# EAGLE board bluepill-breakout (EAGLE 9.6.2)
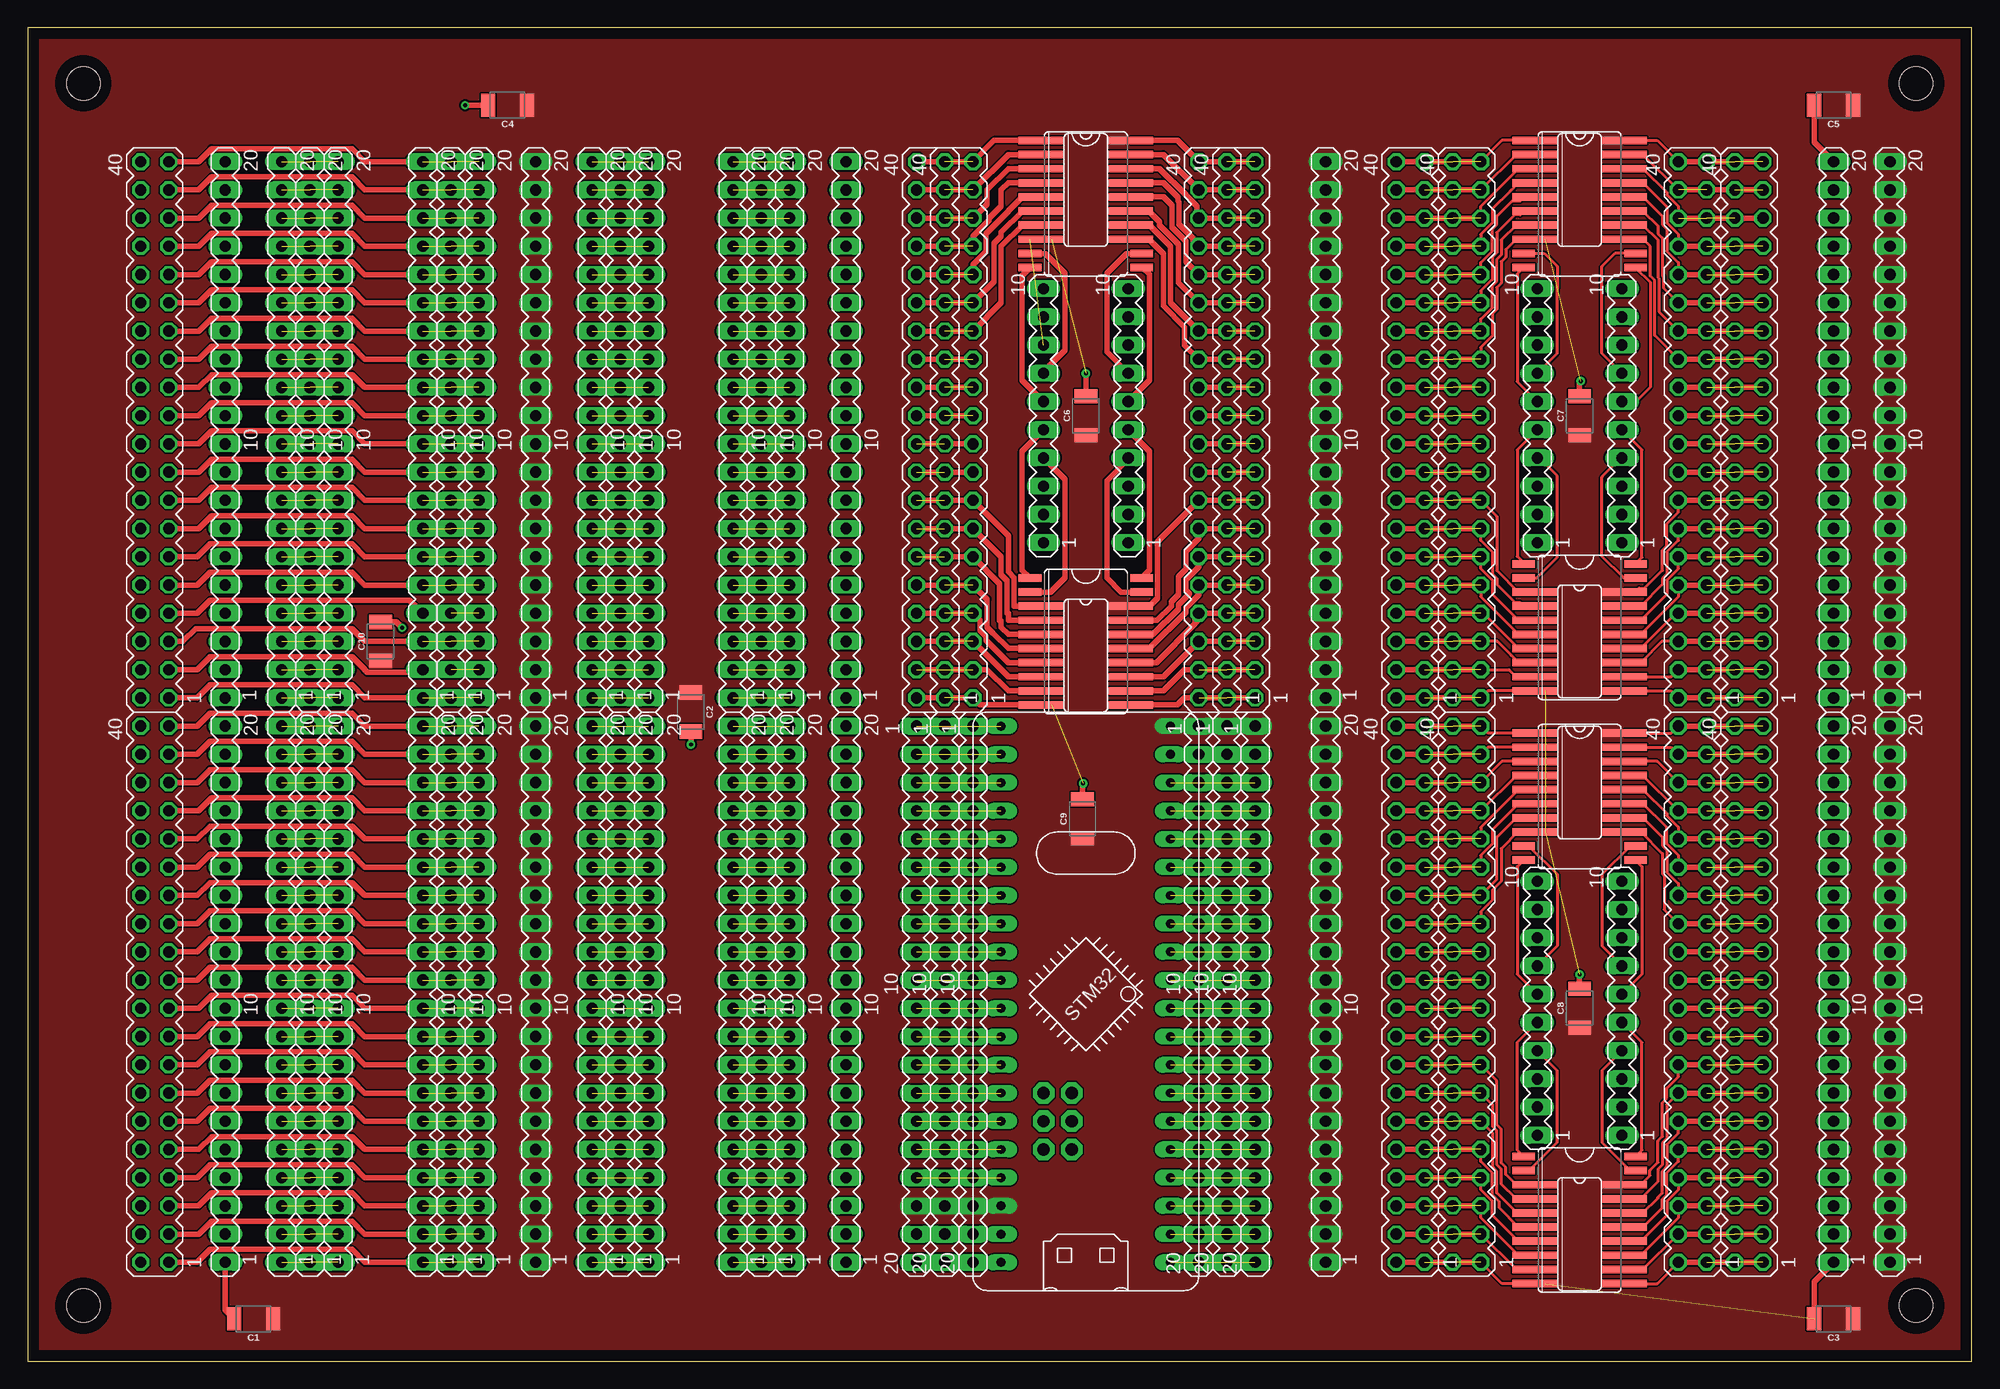
[diagram p3: board, top side]
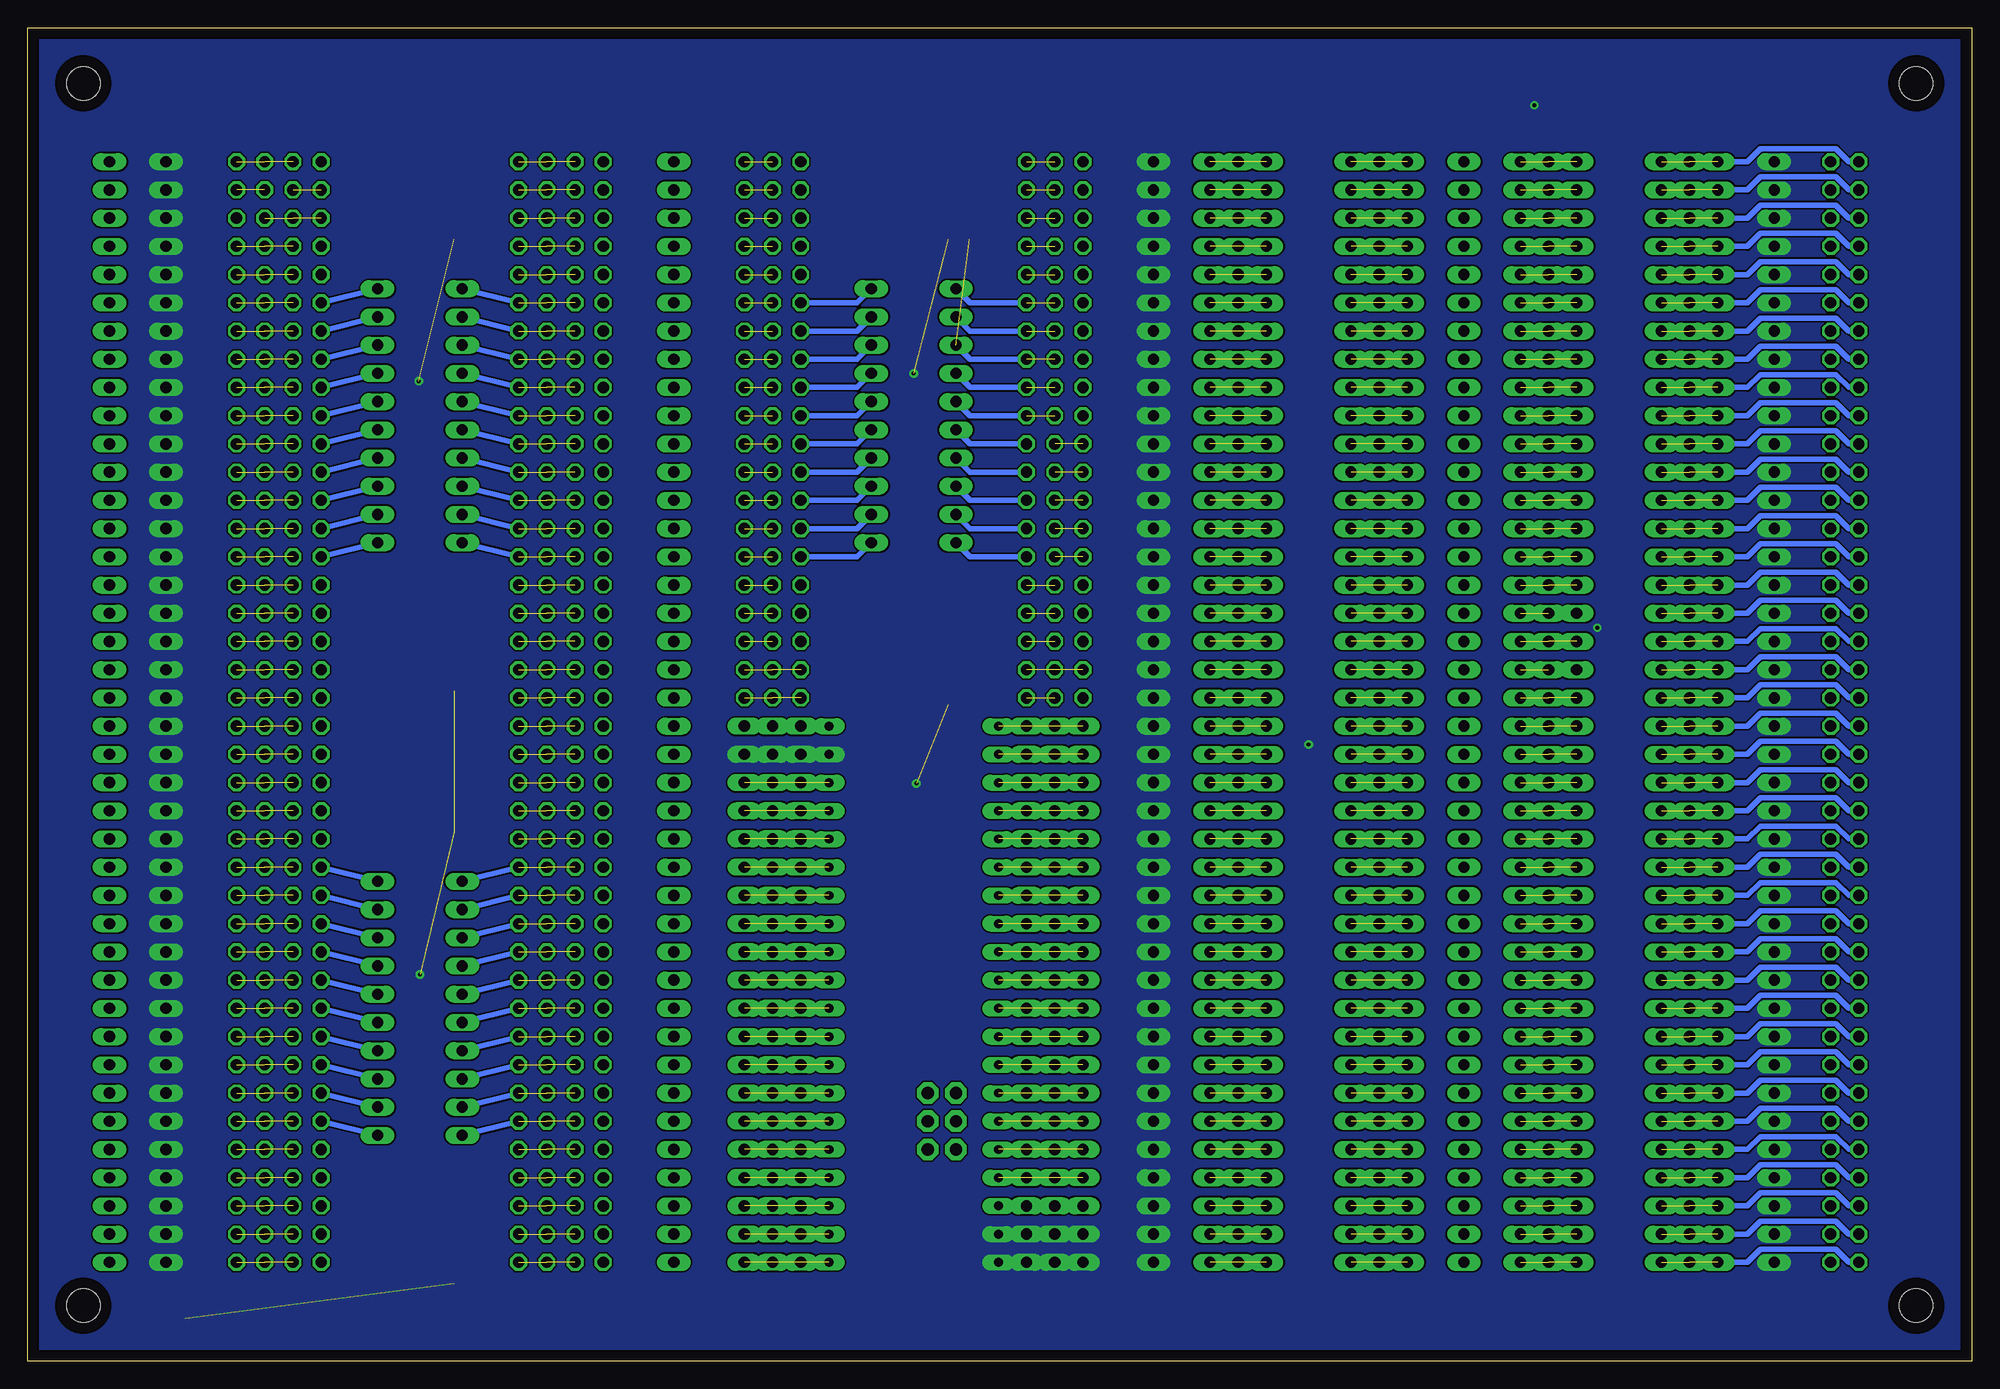
[diagram p4: board, bottom side, seen from below]

Size 175 x 120 mm. Coordinates in mm from the lower left corner, seen from the top.
Outline: 0,0 175,0 175,120 0,120 0,0
Copper layers (1*16): Top 0.035mm / dielectric 1.5mm / Bottom 0.035mm
Design rules "default *": minimum track width 0.5mm, minimum drill 0.35mm, track to track 6mil, track to pad 6mil, pad to pad 6mil, via to via 6mil, smd to smd 6mil, copper to edge 40mil, drill to drill 6mil, minimum pad ring 10mil, minimum via ring 8mil, stop-mask expansion 4mil, vias tented up to drill 0mil, thermal gap 10mil
Holes 3 mm at 5,5 5,115 170,115 170,5

## Footprints (pad centres in the part's own frame; a part is rotated, then mirrored left to right if it is on the bottom)
1210 = smd 1.27 x 2.06: 1 -1.755,0; 2 1.755,0
SO20W = smd 0.66 x 2.032: 1 -5.715,-5.029; 2 -4.445,-5.029; 3 -3.175,-5.029; 4 -1.905,-5.029; 5 -0.635,-5.029; 6 0.635,-5.029; 7 1.905,-5.029; 8 3.175,-5.029; 9 4.445,-5.029; 10 5.715,-5.029; 11 5.715,5.029; 12 4.445,5.029; 13 3.175,5.029; 14 1.905,5.029; 15 0.635,5.029; 16 -0.635,5.029; 17 -1.905,5.029; 18 -3.175,5.029; 19 -4.445,5.029; 20 -5.715,5.029
SO16 = smd 0.66 x 2.032: 1 -4.445,-3.073; 2 -3.175,-3.073; 3 -1.905,-3.073; 4 -0.635,-3.073; 5 0.635,-3.073; 6 1.905,-3.073; 7 3.175,-3.073; 8 4.445,-3.073; 9 4.445,3.073; 10 3.175,3.073; 11 1.905,3.073; 12 0.635,3.073; 13 -0.635,3.073; 14 -1.905,3.073; 15 -3.175,3.073; 16 -4.445,3.073
MA20-1 = drill 1.016 long: 1 -24.13,0; 2 -21.59,0; 3 -19.05,0; 4 -16.51,0; 5 -13.97,0; 6 -11.43,0; 7 -8.89,0; 8 -6.35,0; 9 -3.81,0; 10 -1.27,0; 11 1.27,0; 12 3.81,0; 13 6.35,0; 14 8.89,0; 15 11.43,0; 16 13.97,0; 17 16.51,0; 18 19.05,0; 19 21.59,0; 20 24.13,0
MA20-2 = drill 1.016 octagon: 1 -24.13,-1.27; 2 -24.13,1.27; 3 -21.59,-1.27; 4 -21.59,1.27; 5 -19.05,-1.27; 6 -19.05,1.27; 7 -16.51,-1.27; 8 -16.51,1.27; 9 -13.97,-1.27; 10 -13.97,1.27; 11 -11.43,-1.27; 12 -11.43,1.27; 13 -8.89,-1.27; 14 -8.89,1.27; 15 -6.35,-1.27; 16 -6.35,1.27; 17 -3.81,-1.27; 18 -3.81,1.27; 19 -1.27,-1.27; 20 -1.27,1.27; 21 1.27,-1.27; 22 1.27,1.27; 23 3.81,-1.27; 24 3.81,1.27; 25 6.35,-1.27; 26 6.35,1.27; 27 8.89,-1.27; 28 8.89,1.27; 29 11.43,-1.27; 30 11.43,1.27; 31 13.97,-1.27; 32 13.97,1.27; 33 16.51,-1.27; 34 16.51,1.27; 35 19.05,-1.27; 36 19.05,1.27; 37 21.59,-1.27; 38 21.59,1.27; 39 24.13,-1.27; 40 24.13,1.27
MA10-1 = drill 1.016 long: 1 -11.43,0; 2 -8.89,0; 3 -6.35,0; 4 -3.81,0; 5 -1.27,0; 6 1.27,0; 7 3.81,0; 8 6.35,0; 9 8.89,0; 10 11.43,0
BLUE_PILL_ADV = drill 0.8 pad 1.422 long: P$1 10.16,-30.48; P$2 10.16,-27.94; P$3 10.16,-25.4; P$4 10.16,-22.86; P$5 10.16,-20.32; P$6 10.16,-17.78; P$7 10.16,-15.24; P$8 10.16,-12.7; P$9 10.16,-10.16; P$10 10.16,-7.62; P$11 10.16,-5.08; P$12 10.16,-2.54; P$13 10.16,0; P$14 10.16,2.54; P$15 10.16,5.08; P$16 10.16,7.62; P$17 10.16,10.16; P$18 10.16,12.7; P$19 10.16,15.24; P$20 10.16,17.78; P$21 -5.08,-30.48; P$22 -5.08,-27.94; P$23 -5.08,-25.4; P$24 -5.08,-22.86; P$25 -5.08,-20.32; P$26 -5.08,-17.78; P$27 -5.08,-15.24; P$28 -5.08,-12.7; P$29 -5.08,-10.16; P$30 -5.08,-7.62; P$31 -5.08,-5.08; P$32 -5.08,-2.54; P$33 -5.08,0; P$34 -5.08,2.54; P$35 -5.08,5.08; P$36 -5.08,7.62; P$37 -5.08,10.16; P$38 -5.08,12.7; P$39 -5.08,15.24; P$40 -5.08,17.78 | drill 1.1 pad 1.93 octagon: P$42 -1.27,-20.32; P$43 -1.27,-17.78; P$44 -1.27,-15.24; P$45 1.27,-15.24; P$46 1.27,-17.78; P$47 1.27,-20.32

## Placement (x,y rotation side)
C1  22UF-1210-16V-20%  [1210]  20.32,3.81 180 top
C2  22UF-1210-16V-20%  [1210]  59.69,58.42 270 top
C3  22UF-1210-16V-20%  [1210]  162.56,3.81 180 top
C4  22UF-1210-16V-20%  [1210]  43.18,113.03 180 top
C5  22UF-1210-16V-20%  [1210]  162.56,113.03 180 top
C6  22UF-1210-16V-20%  [1210]  95.25,85.09 90 top
C7  22UF-1210-16V-20%  [1210]  139.7,85.09 90 top
C8  22UF-1210-16V-20%  [1210]  139.7,31.75 90 top
C9  22UF-1210-16V-20%  [1210]  94.95,48.8 90 top
C10  22UF-1210-16V-20%  [1210]  31.75,64.77 90 top
IC2  74LS373DW  [SO20W]  139.7,104.14 270 top
IC3  74LS373DW  [SO20W]  139.7,66.04 270 top
IC4  74LS373DW  [SO20W]  95.25,104.14 270 top
IC5  74LS158D  [SO16]  139.7,105.41 270 top
IC6  74LS373DW  [SO20W]  139.7,50.8 270 top
IC7  74LS373DW  [SO20W]  139.7,12.7 270 top
IC8  74LS158D  [SO16]  139.7,64.77 270 top
IC9  74LS158D  [SO16]  139.7,52.07 270 top
IC10  74LS158D  [SO16]  139.7,11.43 270 top
IC11  74LS373DW  [SO20W]  95.25,64.77 270 top
IC12  74LS158D  [SO16]  95.25,105.41 270 top
IC13  74LS158D  [SO16]  95.25,63.5 270 top
SV1  [MA20-1]  27.94,83.82 90 top
SV2  [MA20-1]  40.64,83.82 90 top
SV3  [MA20-1]  22.86,83.82 90 top
SV4  [MA20-1]  25.4,83.82 90 top
SV5  [MA20-2]  11.43,83.82 90 top
SV6  [MA20-2]  124.46,83.82 90 top
SV7  [MA20-1]  35.56,83.82 90 top
SV8  [MA20-1]  50.8,33.02 90 top
SV9  [MA20-1]  38.1,83.82 90 top
SV10  [MA20-1]  45.72,83.82 90 top
SV11  [MA20-2]  11.43,33.02 90 top
SV12  [MA20-1]  22.86,33.02 90 top
SV13  [MA20-1]  35.56,33.02 90 top
SV14  [MA20-1]  25.4,33.02 90 top
SV15  [MA20-1]  27.94,33.02 90 top
SV16  [MA20-1]  38.1,33.02 90 top
SV17  [MA20-1]  40.64,33.02 90 top
SV18  [MA20-1]  45.72,33.02 90 top
SV19  [MA20-1]  17.78,33.02 90 top
SV20  [MA20-1]  17.78,83.82 90 top
SV21  [MA20-1]  63.5,33.02 90 top
SV22  [MA20-1]  53.34,33.02 90 top
SV23  [MA20-1]  55.88,33.02 90 top
SV24  [MA20-1]  66.04,33.02 90 top
SV25  [MA20-1]  68.58,33.02 90 top
SV26  [MA20-2]  129.54,83.82 90 top
SV27  [MA20-1]  50.8,83.82 90 top
SV28  [MA20-1]  63.5,83.82 90 top
SV29  [MA20-1]  53.34,83.82 90 top
SV30  [MA20-1]  55.88,83.82 90 top
SV31  [MA20-1]  66.04,83.82 90 top
SV32  [MA20-1]  68.58,83.82 90 top
SV33  [MA20-2]  149.86,83.82 90 top
SV34  [MA20-2]  154.94,83.82 90 top
SV35  [MA10-1]  135.89,85.09 90 top
SV36  [MA10-1]  135.89,31.75 90 top
SV37  [MA20-2]  124.46,33.02 90 top
SV38  [MA20-2]  129.54,33.02 90 top
SV39  [MA20-2]  154.94,33.02 90 top
SV40  [MA20-2]  149.86,33.02 90 top
SV41  [MA10-1]  143.51,31.75 90 top
SV42  [MA10-1]  143.51,85.09 90 top
SV43  [MA20-1]  116.84,33.02 90 top
SV44  [MA20-1]  105.41,33.02 270 top
SV45  [MA20-1]  107.95,33.02 270 top
SV46  [MA20-1]  110.49,33.02 270 top
SV47  [MA20-1]  85.09,33.02 270 top
SV48  [MA20-1]  82.55,33.02 270 top
SV49  [MA20-1]  116.84,83.82 90 top
SV50  [MA20-1]  80.01,33.02 270 top
SV51  [MA20-1]  73.66,33.02 90 top
SV52  [MA20-1]  73.66,83.82 90 top
SV53  [MA20-1]  167.64,33.02 90 top
SV54  [MA20-1]  167.64,83.82 90 top
SV55  [MA20-1]  162.56,33.02 90 top
SV56  [MA20-1]  162.56,83.82 90 top
SV57  [MA20-2]  83.82,83.82 90 top
SV58  [MA20-2]  81.28,83.82 90 top
SV59  [MA20-2]  109.22,83.82 90 top
SV60  [MA20-2]  106.68,83.82 90 top
SV61  [MA10-1]  91.44,85.09 90 top
SV62  [MA10-1]  99.06,85.09 90 top
U$1  [BLUE_PILL_ADV]  92.71,39.37 0 top

## Tracks (layer width: path | path; a pad name or v marks a point on that pad's centre or on a via)
GND  (via drill 0.35)  (6 unrouted)
  Top 0.5: C4.2 v39.37,113.03 | C6.2 v95.25,88.9 | SV56.20 160.81,109.7 C5.2 | C3.2 160.81,7.13 SV55.1 | C1.2 17.78,4.59 SV19.1 | C10.2 33.17,66.53 v33.7,66 | C2.2 v59.69,55.51 v59.7,55.5 | v95,52 94.95,51.95 C9.2 | C7.2 139.7,88.1 v139.8,88.2 | C8.2 v139.7,34.8
  pour Bottom (no thermals): -0.84,121.29 -0.84,-2.15 176.54,-2.15 176.54,121.29
N$1  (2 unrouted)
  Bottom 0.5: SV5.2 11.05,59.69 12.22,60.85 19.02,60.85 20.19,59.69 SV1.1
N$2  (2 unrouted)
  Bottom 0.5: SV5.4 11.05,62.23 12.22,63.39 19.02,63.39 20.19,62.23 SV1.2
N$3  (2 unrouted)
  Bottom 0.5: SV5.6 11.05,64.77 12.22,65.93 19.02,65.93 20.19,64.77 SV1.3
N$4  (2 unrouted)
  Bottom 0.5: SV5.8 11.05,67.31 12.22,68.47 19.02,68.47 20.19,67.31 SV1.4
N$5  (2 unrouted)
  Bottom 0.5: SV5.10 11.05,69.85 12.22,71.01 19.02,71.01 20.19,69.85 SV1.5
N$6  (2 unrouted)
  Bottom 0.5: SV5.12 11.05,72.39 12.22,73.55 19.02,73.55 20.19,72.39 SV1.6
N$7  (2 unrouted)
  Bottom 0.5: SV5.14 11.05,74.93 12.22,76.09 19.02,76.09 20.19,74.93 SV1.7
N$8  (2 unrouted)
  Bottom 0.5: SV5.16 11.05,77.47 12.22,78.63 19.02,78.63 20.19,77.47 SV1.8
N$9  (2 unrouted)
  Bottom 0.5: SV5.18 11.05,80.01 12.22,81.17 19.02,81.17 20.19,80.01 SV1.9
N$10  (2 unrouted)
  Bottom 0.5: SV5.20 11.05,82.55 12.22,83.71 19.02,83.71 20.19,82.55 SV1.10
N$11  (2 unrouted)
  Bottom 0.5: SV5.22 11.05,85.09 12.22,86.25 19.02,86.25 20.19,85.09 SV1.11
N$12  (2 unrouted)
  Bottom 0.5: SV5.24 11.05,87.63 12.22,88.79 19.02,88.79 20.19,87.63 SV1.12
N$13  (2 unrouted)
  Bottom 0.5: SV5.26 11.05,90.17 12.22,91.33 19.02,91.33 20.19,90.17 SV1.13
N$14  (2 unrouted)
  Bottom 0.5: SV5.28 11.05,92.71 12.22,93.87 19.02,93.87 20.19,92.71 SV1.14
N$15  (2 unrouted)
  Bottom 0.5: SV5.30 11.05,95.25 12.22,96.41 19.02,96.41 20.19,95.25 SV1.15
N$16  (2 unrouted)
  Bottom 0.5: SV5.32 11.05,97.79 12.22,98.95 19.02,98.95 20.19,97.79 SV1.16
N$17  (2 unrouted)
  Bottom 0.5: SV5.34 11.05,100.33 12.22,101.49 19.02,101.49 20.19,100.33 SV1.17
N$18  (2 unrouted)
  Bottom 0.5: SV5.36 11.05,102.87 12.22,104.03 19.02,104.03 20.19,102.87 SV1.18
N$19  (2 unrouted)
  Bottom 0.5: SV5.38 11.05,105.41 12.22,106.57 19.02,106.57 20.19,105.41 SV1.19
N$20  (2 unrouted)
  Bottom 0.5: SV5.40 11.05,107.95 12.22,109.11 19.02,109.11 20.19,107.95 SV1.20
N$21  (2 unrouted)
  Top 0.5: SV5.1 15.24,59.69 16.4,60.85 29.18,60.85 30.35,59.69 SV2.1
N$22  (1 unrouted)
  Top 0.5: SV5.3 15.24,62.23 16.4,63.39 29.18,63.39 30.32,62.26 30.32,62.21 30.55,61.98 35.31,61.98 SV7.2 SV2.2
N$23  (2 unrouted)
  Top 0.5: SV5.5 13.97,64.77 15.13,65.93 29.18,65.93 30.35,64.77 SV2.3
N$24  (1 unrouted)
  Top 0.5: SV5.7 15.24,67.31 16.4,68.47 29.18,68.47 34.4,68.47 SV7.4 SV2.4
N$25  (2 unrouted)
  Top 0.5: SV5.9 15.24,69.85 16.4,71.01 29.18,71.01 30.35,69.85 SV2.5
N$26  (2 unrouted)
  Top 0.5: SV5.11 15.24,72.39 16.4,73.55 29.18,73.55 30.35,72.39 SV2.6
N$27  (2 unrouted)
  Top 0.5: SV5.13 15.37,74.93 16.54,76.09 29.18,76.09 30.35,74.93 SV2.7
N$28  (2 unrouted)
  Top 0.5: SV5.15 15.37,77.47 16.54,78.63 29.18,78.63 30.35,77.47 SV2.8
N$29  (2 unrouted)
  Top 0.5: SV5.17 15.37,80.01 16.54,81.17 29.18,81.17 30.35,80.01 SV2.9
N$30  (2 unrouted)
  Top 0.5: SV5.19 15.37,82.55 16.54,83.71 29.18,83.71 30.35,82.55 SV2.10
N$31  (2 unrouted)
  Top 0.5: SV5.21 15.37,85.09 16.54,86.25 29.18,86.25 30.35,85.09 SV2.11
N$32  (2 unrouted)
  Top 0.5: SV5.23 15.37,87.63 16.54,88.79 29.18,88.79 30.35,87.63 SV2.12
N$33  (2 unrouted)
  Top 0.5: SV5.25 15.37,90.17 16.54,91.33 29.18,91.33 30.35,90.17 SV2.13
N$34  (2 unrouted)
  Top 0.5: SV5.27 15.37,92.71 16.54,93.87 29.18,93.87 30.35,92.71 SV2.14
N$35  (2 unrouted)
  Top 0.5: SV5.29 15.37,95.25 16.54,96.41 29.18,96.41 30.35,95.25 SV2.15
N$36  (2 unrouted)
  Top 0.5: SV5.31 15.37,97.79 16.54,98.95 29.18,98.95 30.35,97.79 SV2.16
N$37  (2 unrouted)
  Top 0.5: SV5.33 15.37,100.33 16.54,101.49 29.18,101.49 30.35,100.33 SV2.17
N$38  (2 unrouted)
  Top 0.5: SV5.35 15.37,102.87 16.54,104.03 29.18,104.03 30.35,102.87 SV2.18
N$39  (2 unrouted)
  Top 0.5: SV5.37 15.37,105.41 16.54,106.57 29.18,106.57 30.35,105.41 SV2.19
N$40  (2 unrouted)
  Top 0.5: SV5.39 15.37,107.95 16.54,109.11 29.18,109.11 30.35,107.95 SV2.20
N$41  (2 unrouted)
  Bottom 0.5: SV11.2 11.05,8.89 12.22,10.05 19.02,10.05 20.19,8.89 SV15.1
N$42  (2 unrouted)
  Bottom 0.5: SV11.4 11.05,11.43 12.22,12.59 19.02,12.59 20.19,11.43 SV15.2
N$43  (2 unrouted)
  Bottom 0.5: SV11.6 11.05,13.97 12.22,15.13 19.02,15.13 20.19,13.97 SV15.3
N$44  (2 unrouted)
  Bottom 0.5: SV11.8 11.05,16.51 12.22,17.67 19.02,17.67 20.19,16.51 SV15.4
N$45  (2 unrouted)
  Bottom 0.5: SV11.10 11.05,19.05 12.22,20.21 19.02,20.21 20.19,19.05 SV15.5
N$46  (2 unrouted)
  Bottom 0.5: SV11.12 11.05,21.59 12.22,22.75 19.02,22.75 20.19,21.59 SV15.6
N$47  (2 unrouted)
  Bottom 0.5: SV11.14 11.05,24.13 12.22,25.29 19.02,25.29 20.19,24.13 SV15.7
N$48  (2 unrouted)
  Bottom 0.5: SV11.16 11.05,26.67 12.22,27.83 19.02,27.83 20.19,26.67 SV15.8
N$49  (2 unrouted)
  Bottom 0.5: SV11.18 11.05,29.21 12.22,30.37 19.02,30.37 20.19,29.21 SV15.9
N$50  (2 unrouted)
  Bottom 0.5: SV11.20 11.05,31.75 12.22,32.91 19.02,32.91 20.19,31.75 SV15.10
N$51  (2 unrouted)
  Bottom 0.5: SV11.22 11.05,34.29 12.22,35.45 19.02,35.45 20.19,34.29 SV15.11
N$52  (2 unrouted)
  Bottom 0.5: SV11.24 11.05,36.83 12.22,37.99 19.02,37.99 20.19,36.83 SV15.12
N$53  (2 unrouted)
  Bottom 0.5: SV11.26 11.05,39.37 12.22,40.53 19.02,40.53 20.19,39.37 SV15.13
N$54  (2 unrouted)
  Bottom 0.5: SV11.28 11.05,41.91 12.22,43.07 19.02,43.07 20.19,41.91 SV15.14
N$55  (2 unrouted)
  Bottom 0.5: SV11.30 11.05,44.45 12.22,45.61 19.02,45.61 20.19,44.45 SV15.15
N$56  (2 unrouted)
  Bottom 0.5: SV11.32 11.05,46.99 12.22,48.15 19.02,48.15 20.19,46.99 SV15.16
N$57  (2 unrouted)
  Bottom 0.5: SV11.34 11.05,49.53 12.22,50.69 19.02,50.69 20.19,49.53 SV15.17
N$58  (2 unrouted)
  Bottom 0.5: SV11.36 11.05,52.07 12.22,53.23 19.02,53.23 20.19,52.07 SV15.18
N$59  (2 unrouted)
  Bottom 0.5: SV11.38 11.05,54.61 12.22,55.77 19.02,55.77 20.19,54.61 SV15.19
N$60  (2 unrouted)
  Bottom 0.5: SV11.40 11.05,57.15 12.22,58.31 19.02,58.31 20.19,57.15 SV15.20
N$61  (2 unrouted)
  Top 0.5: SV11.1 15.24,8.89 16.4,10.05 29.18,10.05 30.35,8.89 SV17.1
N$62  (2 unrouted)
  Top 0.5: SV11.3 15.37,11.43 16.54,12.59 29.18,12.59 30.35,11.43 SV17.2
N$63  (2 unrouted)
  Top 0.5: SV11.5 15.37,13.97 16.54,15.13 29.18,15.13 30.35,13.97 SV17.3
N$64  (2 unrouted)
  Top 0.5: SV11.7 15.24,16.51 16.4,17.67 29.18,17.67 30.35,16.51 SV17.4
N$65  (2 unrouted)
  Top 0.5: SV11.9 15.37,19.05 16.54,20.21 29.18,20.21 30.35,19.05 SV17.5
N$66  (2 unrouted)
  Top 0.5: SV11.11 15.24,21.59 16.4,22.75 29.18,22.75 30.35,21.59 SV17.6
N$67  (2 unrouted)
  Top 0.5: SV11.13 15.24,24.13 16.4,25.29 29.18,25.29 30.35,24.13 SV17.7
N$68  (2 unrouted)
  Top 0.5: SV11.15 15.24,26.67 16.4,27.83 29.18,27.83 30.35,26.67 SV17.8
N$69  (2 unrouted)
  Top 0.5: SV11.17 15.24,29.21 16.4,30.37 29.18,30.37 30.35,29.21 SV17.9
N$70  (2 unrouted)
  Top 0.5: SV11.19 15.37,31.75 16.54,32.91 29.18,32.91 30.35,31.75 SV17.10
N$71  (2 unrouted)
  Top 0.5: SV11.21 15.24,34.29 16.4,35.45 29.18,35.45 30.35,34.29 SV17.11
N$72  (2 unrouted)
  Top 0.5: SV11.23 15.24,36.83 16.4,37.99 29.18,37.99 30.35,36.83 SV17.12
N$73  (2 unrouted)
  Top 0.5: SV11.25 15.24,39.37 16.4,40.53 29.18,40.53 30.35,39.37 SV17.13
N$74  (2 unrouted)
  Top 0.5: SV11.27 15.24,41.91 16.4,43.07 29.18,43.07 30.35,41.91 SV17.14
N$75  (2 unrouted)
  Top 0.5: SV11.29 15.24,44.45 16.4,45.61 29.18,45.61 30.35,44.45 SV17.15
N$76  (2 unrouted)
  Top 0.5: SV11.31 15.24,46.99 16.4,48.15 29.18,48.15 30.35,46.99 SV17.16
N$77  (2 unrouted)
  Top 0.5: SV11.33 15.37,49.53 16.54,50.69 29.18,50.69 30.35,49.53 SV17.17
N$78  (2 unrouted)
  Top 0.5: SV11.35 15.24,52.07 16.4,53.23 29.18,53.23 30.35,52.07 SV17.18
N$79  (2 unrouted)
  Top 0.5: SV11.37 15.24,54.61 16.4,55.77 29.18,55.77 30.35,54.61 SV17.19
N$80  (2 unrouted)
  Top 0.5: SV11.39 15.24,57.15 16.4,58.31 29.18,58.31 30.35,57.15 SV17.20
N$81  (2 unrouted)
N$82  (2 unrouted)
N$83  (2 unrouted)
N$84  (2 unrouted)
N$85  (2 unrouted)
N$86  (2 unrouted)
N$87  (2 unrouted)
N$88  (2 unrouted)
N$89  (2 unrouted)
N$90  (2 unrouted)
N$91  (2 unrouted)
N$92  (2 unrouted)
N$93  (2 unrouted)
N$94  (2 unrouted)
N$95  (2 unrouted)
N$96  (2 unrouted)
N$97  (2 unrouted)
N$98  (2 unrouted)
N$99  (2 unrouted)
N$100  (2 unrouted)
N$101  (2 unrouted)
N$102  (2 unrouted)
N$103  (2 unrouted)
N$104  (2 unrouted)
N$105  (2 unrouted)
N$106  (2 unrouted)
N$107  (2 unrouted)
N$108  (2 unrouted)
N$109  (2 unrouted)
N$110  (2 unrouted)
N$111  (2 unrouted)
N$112  (2 unrouted)
N$113  (2 unrouted)
N$114  (2 unrouted)
N$115  (2 unrouted)
N$116  (2 unrouted)
N$117  (2 unrouted)
N$118  (2 unrouted)
N$119  (2 unrouted)
N$120  (2 unrouted)
N$121  (2 unrouted)
N$122  (2 unrouted)
N$123  (2 unrouted)
N$124  (2 unrouted)
N$125  (2 unrouted)
N$126  (2 unrouted)
N$127  (2 unrouted)
N$128  (2 unrouted)
N$129  (2 unrouted)
N$130  (2 unrouted)
N$131  (2 unrouted)
N$132  (2 unrouted)
N$133  (2 unrouted)
N$134  (2 unrouted)
N$135  (2 unrouted)
N$136  (2 unrouted)
N$137  (2 unrouted)
N$138  (2 unrouted)
N$139  (2 unrouted)
N$140  (2 unrouted)
N$141  (2 unrouted)
N$142  (2 unrouted)
N$143  (2 unrouted)
N$144  (2 unrouted)
N$145  (2 unrouted)
N$146  (2 unrouted)
N$147  (2 unrouted)
N$148  (2 unrouted)
N$149  (2 unrouted)
N$150  (2 unrouted)
N$151  (2 unrouted)
N$152  (2 unrouted)
N$153  (2 unrouted)
N$154  (2 unrouted)
N$155  (2 unrouted)
N$156  (2 unrouted)
N$157  (2 unrouted)
N$158  (2 unrouted)
N$159  (2 unrouted)
N$160  (2 unrouted)
N$161  (2 unrouted)
  Top 0.25: IC3.10 131.44,60.33 SV26.1
  Top 0.5: SV26.1 SV6.2
N$162  (2 unrouted)
  Top 0.25: SV26.3 133.35,62.23 133.99,61.59 IC3.9
  Top 0.5: SV26.3 SV6.4
N$163  (2 unrouted)
  Top 0.25: SV26.5 132.3,64.77 133.54,63.53 134.2,62.87 IC3.8
  Top 0.5: SV26.5 SV6.6
N$164  (2 unrouted)
  Top 0.25: SV26.7 131.03,67.31 134.2,64.14 IC3.7
  Top 0.5: SV26.7 SV6.8
N$165  (2 unrouted)
  Top 0.25: SV26.9 130.81,68.8 134.2,65.41 IC3.6
  Top 0.5: SV26.9 SV6.10
N$166  (2 unrouted)
  Top 0.25: SV26.11 130.81,71.32 131.85,70.28 131.85,69.03 134.2,66.67 IC3.5
  Top 0.5: SV26.11 SV6.12
  Bottom 0.5: SV26.11 SV35.1
N$167  (2 unrouted)
  Top 0.25: IC3.4 134.33,68.29 133.86,68.29 132.25,69.89 132.25,70.45 131.85,70.85 131.85,72.82 130.81,73.86 SV26.13
  Top 0.5: SV26.13 SV6.14
  Bottom 0.5: SV35.2 SV26.13
N$168  (2 unrouted)
  Top 0.25: SV26.15 132.25,76.03 132.25,71.17 134.2,69.22 IC3.3
  Top 0.5: SV26.15 SV6.16
  Bottom 0.5: SV35.3 SV26.15
N$169  (2 unrouted)
  Top 0.25: IC3.2 134.71,70.45 135.8,70.45 137.69,72.34 137.69,79.68 136.09,81.28 SV35.4
  Top 0.5: SV26.17 SV6.18
  Bottom 0.5: SV35.4 SV26.17
N$170  (2 unrouted)
  Top 0.25: IC3.1 134.67,71.85 134.09,72.43 134.09,82.02 SV35.5
  Top 0.5: SV26.19 SV6.20
  Bottom 0.5: SV35.5 SV26.19
N$171  (2 unrouted)
  Top 0.25: IC2.10 134.09,97.85 134.09,88.16 SV35.6
  Top 0.5: SV26.21 SV6.22
  Bottom 0.5: SV35.6 SV26.21
N$172  (2 unrouted)
  Top 0.25: 133.99,99.69 IC2.9 136.53,99.69 137.69,98.53 137.69,96.52 | SV35.7 137.69,90.7 137.69,96.52 | 137.69,96.52 137.69,97.14
  Top 0.5: SV26.23 SV6.24
  Bottom 0.5: SV35.7 SV26.23
N$173  (2 unrouted)
  Top 0.25: SV26.25 130.81,91.24 131.85,92.28 131.85,94.25 132.25,94.65 132.25,96.62 132.65,97.03 132.65,98.95 133.06,99.35 133.06,100.04 133.99,100.97 IC2.8
  Top 0.5: SV26.25 SV6.26
  Bottom 0.5: SV35.8 SV26.25
N$174  (2 unrouted)
  Top 0.25: IC2.7 133.99,102.23 132.65,100.9 132.65,99.57 132.25,99.16 132.25,97.19 131.85,96.79 131.85,94.82 130.81,93.78 SV26.27
  Top 0.5: SV26.27 SV6.28
  Bottom 0.5: SV35.9 SV26.27
N$175  (2 unrouted)
  Top 0.25: IC2.6 134.33,103.16 133.86,103.16 132.25,101.56 132.25,99.73 131.85,99.33 131.85,97.36 130.81,96.32 SV26.29
  Top 0.5: SV26.29 SV6.30
  Bottom 0.5: SV35.10 SV26.29
N$176  (2 unrouted)
  Top 0.25: IC2.5 134.33,104.43 133.64,104.43 132.25,103.04 132.25,102.27 131.85,101.87 131.85,99.9 130.81,98.86 SV26.31
  Top 0.5: SV6.32 SV26.31
N$177  (2 unrouted)
  Top 0.25: SV26.33 130.81,101.4 131.85,102.44 131.85,103.69 133.46,105.3 | 133.54,105.38 133.46,105.3 | 133.46,105.3 134.2,106.05 IC2.4
  Top 0.5: SV6.34 SV26.33
N$178  (2 unrouted)
  Top 0.25: SV26.35 130.81,103.92 134.2,107.31 IC2.3
  Top 0.5: SV6.36 SV26.35
N$179  (2 unrouted)
  Top 0.25: IC2.2 133.99,108.58 SV26.37
  Top 0.5: SV6.38 SV26.37
N$180  (2 unrouted)
  Top 0.25: IC2.1 132.72,109.86 SV26.39
  Top 0.5: SV26.39 SV6.40
N$181  (2 unrouted)
  Top 0.25: IC3.11 147.96,60.33 SV33.2
  Top 0.5: SV33.2 SV34.1
N$182  (2 unrouted)
  Top 0.25: IC3.12 147.96,61.59 SV33.4
  Top 0.5: SV33.4 SV34.3
N$183  (2 unrouted)
  Top 0.25: SV33.6 147.1,64.77 145.2,62.87 IC3.13
  Top 0.5: SV33.6 SV34.5
N$184  (2 unrouted)
  Top 0.25: SV33.8 148.37,67.31 145.2,64.14 IC3.14
  Top 0.5: SV33.8 SV34.7
N$185  (2 unrouted)
  Top 0.25: SV33.10 148.59,68.8 145.2,65.41 IC3.15
  Top 0.5: SV33.10 SV34.9
N$186  (2 unrouted)
  Top 0.25: SV33.12 148.59,71.32 147.55,70.28 147.55,69.03 145.2,66.67 IC3.16
  Top 0.5: SV33.12 SV34.11
  Bottom 0.5: SV42.1 SV33.12
N$187  (2 unrouted)
  Top 0.25: SV33.14 148.59,73.86 147.55,72.82 147.55,70.85 147.15,70.45 147.15,69.89 145.2,67.94 IC3.17
  Top 0.5: SV33.14 SV34.13
  Bottom 0.5: SV33.14 SV42.2
N$188  (2 unrouted)
  Top 0.25: IC3.18 145.07,69.56 145.54,69.56 147.15,71.17 147.15,72.99 147.55,73.39 147.55,75.36 148.59,76.4 SV33.16
  Top 0.5: SV33.16 SV34.15
  Bottom 0.5: SV33.16 SV42.3
N$189  (2 unrouted)
  Top 0.25: IC3.19 143.66,70.48 141.71,72.44 141.71,79.57 143.42,81.28 SV42.4
  Top 0.5: SV33.18 SV34.17
  Bottom 0.5: SV33.18 SV42.4
N$190  (2 unrouted)
  Top 0.25: IC3.20 145.31,72.33 145.31,82.02 SV42.5
  Top 0.5: SV33.20 SV34.19
  Bottom 0.5: SV33.20 SV42.5
N$191  (2 unrouted)
  Top 0.25: IC2.11 146.05,97.1 146.05,87.63 144.78,86.36 SV42.6
  Top 0.5: SV34.21 SV33.22
  Bottom 0.5: SV33.22 SV42.6
N$192  (2 unrouted)
  Top 0.25: IC2.12 142.88,99.69 141.71,98.53 141.71,90.7 SV42.7
  Top 0.5: SV34.23 SV33.24
  Bottom 0.5: SV33.24 SV42.7
N$193  (2 unrouted)
  Top 0.25: IC2.13 145.41,100.97 146.05,100.33 146.05,97.67 146.45,97.27 146.45,92.31 SV33.26
  Top 0.5: SV34.25 SV33.26
  Bottom 0.5: SV33.26 SV42.8
N$194  (2 unrouted)
  Top 0.25: IC2.14 145.41,102.23 146.75,100.9 146.75,97.55 146.85,97.44 146.85,94.44 SV33.28
  Top 0.5: SV34.27 SV33.28
  Bottom 0.5: SV33.28 SV42.9
N$195  (2 unrouted)
  Top 0.25: IC2.15 145.41,103.5 146.75,102.17 146.75,101.47 147.15,101.07 147.15,97.71 147.26,97.6 147.26,96.58 SV33.30
  Top 0.5: SV34.29 SV33.30
  Bottom 0.5: SV33.30 SV42.10
N$196  (2 unrouted)
  Top 0.25: SV33.32 148.59,98.86 147.55,99.9 147.55,101.87 147.15,102.27 147.15,103.04 145.41,104.78 IC2.16
  Top 0.5: SV34.31 SV33.32
N$197  (2 unrouted)
  Top 0.25: SV33.34 148.59,101.4 147.55,102.44 147.55,103.91 145.41,106.05 IC2.17
  Top 0.5: SV34.33 SV33.34
N$198  (2 unrouted)
  Top 0.25: SV33.36 148.59,103.92 147.55,104.96 147.55,105.18 145.41,107.31 IC2.18
  Top 0.5: SV34.35 SV33.36
N$199  (2 unrouted)
  Top 0.25: IC2.19 145.41,108.58 SV33.38
  Top 0.5: SV34.37 SV33.38
N$200  (2 unrouted)
  Top 0.25: IC2.20 146.69,109.86 SV33.40
  Top 0.5: SV34.39 SV33.40
N$203  (3 unrouted)
N$204  (3 unrouted)
N$205  (3 unrouted)
N$206  (3 unrouted)
N$207  (3 unrouted)
N$208  (3 unrouted)
N$209  (3 unrouted)
N$210  (3 unrouted)
N$211  (3 unrouted)
N$212  (3 unrouted)
N$213  (3 unrouted)
N$214  (3 unrouted)
N$215  (3 unrouted)
N$216  (3 unrouted)
N$217  (3 unrouted)
N$218  (3 unrouted)
N$219  (3 unrouted)
N$220  (3 unrouted)
N$221  (3 unrouted)
N$222  (3 unrouted)
N$223  (3 unrouted)
N$224  (3 unrouted)
N$225  (3 unrouted)
N$226  (3 unrouted)
N$227  (3 unrouted)
N$228  (3 unrouted)
N$229  (3 unrouted)
N$230  (3 unrouted)
N$231  (3 unrouted)
N$232  (3 unrouted)
N$233  (3 unrouted)
N$234  (3 unrouted)
N$235  (3 unrouted)
N$236  (3 unrouted)
N$237  (3 unrouted)
N$239  (2 unrouted)
  Top 0.5: IC11.9 88.27,60.33 86.36,62.23 SV58.4
N$241  (1 unrouted)
  Top 0.5: IC11.7 88.27,62.87 86.25,64.88 86.25,65.25 85.71,65.8 85.71,66.69 SV57.7 SV58.8
N$242  (1 unrouted)
  Top 0.5: IC11.6 88.27,64.14 86.91,65.49 86.91,65.52 86.36,66.07 86.36,68.58 SV57.9 SV58.10
N$243  (1 unrouted)
  Top 0.5: SV58.12 SV57.11 87.5,69.98 87.5,66.64 87.63,66.64 87.63,66.04 88.27,65.41 IC11.5
  Bottom 0.5: SV61.1 90.17,72.39 SV57.11
N$245  (1 unrouted)
  Top 0.5: SV58.16 SV57.15 88.28,74.28 88.28,71.04 88.8,70.52 88.8,67.94 IC11.3
  Bottom 0.5: SV61.3 90.17,77.47 SV57.15
N$246  (1 unrouted)
  Top 0.5: SV58.18 SV57.17 | SV61.4 93.37,79.35 93.37,70.51 92.08,69.22 IC11.2
  Bottom 0.5: SV61.4 90.17,80.01 SV57.17
N$247  (1 unrouted)
  Top 0.5: SV58.20 SV57.19 | IC11.1 90.21,70.48 89.51,71.18 89.51,81.89 SV61.5
  Bottom 0.5: SV61.5 90.17,82.55 SV57.19
N$248  (1 unrouted)
  Top 0.5: SV58.22 SV57.21 | IC4.10 89.51,97.7 89.51,88.29 SV61.6
  Bottom 0.5: SV61.6 90.17,85.09 SV57.21
N$249  (1 unrouted)
  Top 0.5: SV58.24 SV57.23 | IC4.9 90.26,99.66 91.6,99.66 93.37,97.89 93.37,90.96 91.44,89.03 SV61.7
  Bottom 0.5: SV61.7 90.17,87.63 SV57.23
N$251  (1 unrouted)
  Top 0.5: SV58.28 SV57.27 87.63,95.25 87.63,100.33 89.53,102.23 IC4.7
  Bottom 0.5: SV61.9 90.17,92.71 SV57.27
N$252  (1 unrouted)
  Top 0.5: SV58.30 SV57.29 86.98,97.14 86.98,100.6 87.63,101.25 87.63,101.6 89.53,103.5 IC4.6
  Bottom 0.5: SV61.10 90.17,95.25 SV57.29
N$253  (1 unrouted)
  Top 0.5: SV58.32 SV57.31 85.09,98.68 86.25,99.85 86.25,101.47 88.28,103.49 88.28,103.52 89.53,104.78 IC4.5
N$255  (1 unrouted)
  Top 0.5: SV58.36 SV57.35 86.36,104.14 86.36,105.41 88.27,107.31 88.9,107.31 IC4.3
N$256  (1 unrouted)
  Top 0.5: SV58.38 SV57.37 88.27,108.58 IC4.2
N$257  (1 unrouted)
  Top 0.5: SV58.40 SV57.39 87,109.86 IC4.1
N$258  (2 unrouted)
  Top 0.5: IC11.11 103.5,59.05 104.14,59.69 SV59.1
N$259  (2 unrouted)
  Top 0.5: IC11.12 102.23,60.33 104.14,62.23 SV59.3
N$260  (1 unrouted)
  Top 0.5: IC11.13 102.23,61.59 SV60.6 SV59.5
N$261  (1 unrouted)
  Top 0.5: IC11.14 101.6,62.87 105.09,66.36 | 105.09,66.36 106.05,67.31 106.68,67.31 | 106.68,67.31 SV59.7 | 106.68,67.31 SV60.8 105.09,66.99 105.09,66.36
N$262  (1 unrouted)
  Top 0.5: SV59.9 SV60.10 105.41,68.96 104.25,67.79 104.25,67.42 100.97,64.14 IC11.15
N$263  (1 unrouted)
  Top 0.5: SV59.11 SV60.12 105.41,71.5 104.25,70.33 104.25,69.37 104.57,69.04 103.59,68.06 103.59,67.69 101.31,65.41 IC11.16
  Bottom 0.5: SV62.1 100.33,72.39 SV60.12
N$264  (1 unrouted)
  Top 0.5: SV59.13 SV60.14 105.41,74.04 104.25,72.87 104.25,71.25 103.59,70.6 103.59,68.98 102.94,68.33 102.94,67.96 101.66,66.67 IC11.17
  Bottom 0.5: SV62.2 100.33,74.93 SV60.14
N$265  (1 unrouted)
  Top 0.5: SV59.15 SV60.16 101.7,73.76 101.7,68.68 100.97,67.94 IC11.18
  Bottom 0.5: SV62.3 100.33,77.47 SV60.16
N$266  (1 unrouted)
  Top 0.5: SV60.18 SV59.17 | SV62.4 99.06,81.15 97.13,79.22 97.13,70.51 98.42,69.22 IC11.19
  Bottom 0.5: SV62.4 100.33,80.01 SV60.18
N$267  (1 unrouted)
  Top 0.5: SV60.20 SV59.19 | SV62.5 100.99,81.89 100.99,71.18 100.29,70.48 IC11.20
  Bottom 0.5: SV62.5 100.33,82.55 SV60.20
N$268  (1 unrouted)
  Top 0.5: SV60.22 SV59.21 | IC4.11 100.36,98.42 100.99,97.8 100.99,88.29 SV62.6
  Bottom 0.5: SV62.6 100.33,85.09 SV60.22
N$269  (1 unrouted)
  Top 0.5: SV60.24 SV59.23 | IC4.12 100.24,99.66 98.9,99.66 97.13,97.89 97.13,90.83 SV62.7
  Bottom 0.5: SV62.7 100.33,87.63 SV60.24
N$270  (1 unrouted)
  Top 0.5: SV59.25 SV60.26 104.14,91.44 104.14,93.06 102.22,94.98 102.22,99.67 100.92,100.97 IC4.13
  Bottom 0.5: SV62.8 100.33,90.17 SV60.26
N$271  (1 unrouted)
  Top 0.5: SV59.27 SV60.28 102.87,95.25 102.87,100.33 100.97,102.23 IC4.14
  Bottom 0.5: SV62.9 100.33,92.71 SV60.28
N$272  (1 unrouted)
  Top 0.5: SV59.29 SV60.30 103.59,97.07 103.59,100.53 101.89,102.23 101.89,102.54 101.58,102.85 100.92,103.5 IC4.15
  Bottom 0.5: SV62.10 100.33,95.25 SV60.30
N$273  (1 unrouted)
  Top 0.5: SV59.31 SV60.32 104.25,98.95 104.25,100.8 103,102.04 103,104.01 102.23,104.78 IC4.16
N$274  (1 unrouted)
  Top 0.5: SV59.33 SV60.34 104.9,100.84 104.9,101.07 103.66,102.31 103.66,104.28 103.52,104.41 103.52,104.76 102.23,106.05 IC4.17
N$275  (1 unrouted)
  Top 0.5: SV59.35 SV60.36 105.37,102.87 105.24,103 105.24,103.93 104.25,104.93 104.25,104.96 101.89,107.31 IC4.18
N$276  (1 unrouted)
  Top 0.5: SV59.37 SV60.38 102.23,108.58 IC4.19
N$278  (1 unrouted)
  Top 0.5: IC11.10 85.72,59.05 SV57.1 SV58.2
N$279  (1 unrouted)
  Top 0.5: IC11.8 88.27,61.59 SV57.5 SV58.6
N$281  (1 unrouted)
  Top 0.5: SV58.14 SV57.13 87.63,72.39 87.63,70.77 88.15,70.25 88.15,67.29 88.28,67.29 88.28,66.67 IC11.4
  Bottom 0.5: SV61.2 90.17,74.93 SV57.13
N$284  (2 unrouted)
  Top 0.5: SV58.26 SV57.25
  Bottom 0.5: SV61.8 90.17,90.17 SV57.25
N$286  (1 unrouted)
  Top 0.5: SV58.34 SV57.33 85.09,101.22 86.55,102.68 86.55,102.87 87.63,103.95 87.63,105.41 88.27,106.05 IC4.4
N$319  (1 unrouted)
  Top 0.5: SV59.39 SV60.40 103.5,109.86 IC4.20
N$441  (2 unrouted)
  Top 0.25: IC7.10 132.72,6.99 SV38.1
  Top 0.5: SV37.2 SV38.1
N$442  (2 unrouted)
  Top 0.25: IC7.9 133.99,8.26 SV38.3
  Top 0.5: SV37.4 SV38.3
N$443  (2 unrouted)
  Top 0.25: SV38.5 130.81,12.92 134.2,9.53 IC7.8
  Top 0.5: SV37.6 SV38.5
N$444  (2 unrouted)
  Top 0.25: SV38.7 130.81,15.44 131.85,14.4 131.85,13.15 134.2,10.79 IC7.7
  Top 0.5: SV37.8 SV38.7
N$445  (2 unrouted)
  Top 0.25: SV38.9 130.81,17.98 131.85,16.94 131.85,16.08 131.83,16.06 131.83,14.99 132.47,14.36 132.47,13.8 134.2,12.06 IC7.6
  Top 0.5: SV37.10 SV38.9
N$446  (2 unrouted)
  Top 0.25: IC7.5 134.05,13.34 132.25,15.14 132.25,17.11 131.83,17.53 131.85,17.55 131.85,20.55 SV38.11
  Top 0.5: SV38.11 SV37.12
  Bottom 0.5: SV36.1 SV38.11
N$447  (2 unrouted)
  Top 0.25: IC7.4 133.99,14.61 132.65,15.94 132.65,17.27 132.25,17.68 132.25,20.72 131.85,21.12 131.85,23.09 SV38.13
  Top 0.5: SV38.13 SV37.14
  Bottom 0.5: SV36.2 SV38.13
N$448  (2 unrouted)
  Top 0.25: IC7.3 133.99,15.88 133.06,16.8 133.06,17.44 132.65,17.84 132.65,20.88 132.25,21.29 132.25,25.23 SV38.15
  Top 0.5: SV37.16 SV38.15
  Bottom 0.5: SV36.3 SV38.15
N$449  (2 unrouted)
  Top 0.25: SV36.4 137.69,26.14 137.69,19.7 135.14,17.14 IC7.2
  Top 0.5: SV38.17 SV37.18
  Bottom 0.5: SV36.4 SV38.17
N$450  (2 unrouted)
  Top 0.25: IC7.1 134.09,18.99 134.09,28.68 SV36.5
  Top 0.5: SV38.19 SV37.20
  Bottom 0.5: SV36.5 SV38.19
N$451  (2 unrouted)
  Top 0.25: IC6.10 134.09,44.51 134.09,34.82 SV36.6
  Top 0.5: SV38.21 SV37.22
  Bottom 0.5: SV36.6 SV38.21
N$452  (2 unrouted)
  Top 0.25: SV36.7 137.69,37.36 137.69,43.8 135.14,46.35 IC6.9
  Top 0.5: SV38.23 SV37.24
  Bottom 0.5: SV36.7 SV38.23
N$453  (2 unrouted)
  Top 0.25: SV38.25 130.81,40.44 131.85,41.48 131.85,42.38 132.65,43.19 132.65,46.12 134.16,47.62 IC6.8
  Top 0.5: SV38.25 SV37.26
  Bottom 0.5: SV36.8 SV38.25
N$454  (2 unrouted)
  Top 0.25: IC6.7 133.99,48.9 132.25,47.16 132.25,43.35 SV38.27
  Top 0.5: SV38.27 SV37.28
  Bottom 0.5: SV38.27 SV36.9
N$455  (2 unrouted)
  Top 0.25: SV38.29 130.81,45.52 131.85,46.56 131.85,47.81 134.2,50.16 IC6.6
  Top 0.5: SV38.29 SV37.30
  Bottom 0.5: SV38.29 SV36.10
N$456  (2 unrouted)
  Top 0.25: SV38.31 130.81,48.04 134.2,51.44 IC6.5
  Top 0.5: SV38.31 SV37.32
N$457  (2 unrouted)
  Top 0.25: IC6.4 133.99,52.7 SV38.33
  Top 0.5: SV38.33 SV37.34
N$458  (2 unrouted)
  Top 0.25: IC6.3 132.72,53.98 SV38.35
  Top 0.5: SV38.35 SV37.36
N$459  (2 unrouted)
  Top 0.25: IC6.2 131.44,55.24 SV38.37
  Top 0.5: SV38.37 SV37.38
N$460  (2 unrouted)
  Top 0.25: IC6.1 131.44,56.52 SV38.39
  Top 0.5: SV37.40 SV38.39
N$461  (2 unrouted)
  Top 0.25: IC7.11 146.69,6.99 SV40.2
  Top 0.5: SV40.2 SV39.1
N$462  (2 unrouted)
  Top 0.25: IC7.12 145.41,8.26 SV40.4
  Top 0.5: SV39.3 SV40.4
N$463  (2 unrouted)
  Top 0.25: SV40.6 148.59,12.92 145.2,9.53 IC7.13
  Top 0.5: SV40.6 SV39.5
N$464  (2 unrouted)
  Top 0.25: IC7.14 145.2,10.79 147.55,13.15 147.55,14.4 148.59,15.44 SV40.8
  Top 0.5: SV40.8 SV39.7
N$465  (2 unrouted)
  Top 0.25: IC7.15 145.41,12.06 147.15,13.8 147.15,14.57 147.55,14.97 147.55,16.94 148.59,17.98 SV40.10
  Top 0.5: SV40.10 SV39.9
N$466  (2 unrouted)
  Top 0.25: SV40.12 148.59,20.52 147.55,19.48 147.55,17.55 147.57,17.53 147.15,17.11 147.15,15.14 146.75,14.73 146.75,14.67 145.41,13.34 IC7.16
  Top 0.5: SV39.11 SV40.12
  Bottom 0.5: SV41.1 SV40.12
N$467  (2 unrouted)
  Top 0.25: SV40.14 147.55,23.09 147.55,20.05 147.15,19.65 147.15,17.68 146.75,17.27 146.75,16.15 145.2,14.61 IC7.17
  Top 0.5: SV39.13 SV40.14
  Bottom 0.5: SV41.2 SV40.14
N$468  (2 unrouted)
  Top 0.25: SV40.16 148.59,25.6 147.55,24.56 147.55,23.66 147.15,23.26 147.15,20.22 146.75,19.81 146.75,17.89 146.02,17.17 146.02,16.7 145.2,15.88 IC7.18
  Top 0.5: SV39.15 SV40.16
  Bottom 0.5: SV41.3 SV40.16
N$469  (2 unrouted)
  Top 0.25: SV41.4 141.71,26.14 141.71,19.7 144.26,17.14 IC7.19
  Top 0.5: SV39.17 SV40.18
  Bottom 0.5: SV41.4 SV40.18
N$470  (2 unrouted)
  Top 0.25: IC7.20 145.31,18.99 145.31,28.68 SV41.5
  Top 0.5: SV39.19 SV40.20
  Bottom 0.5: SV41.5 SV40.20
N$471  (2 unrouted)
  Top 0.25: IC6.11 145.31,44.51 145.31,34.82 SV41.6
  Top 0.5: SV40.22 SV39.21
  Bottom 0.5: SV41.6 SV40.22
N$472  (2 unrouted)
  Top 0.25: SV41.7 141.71,37.36 141.71,43.8 144.26,46.35 IC6.12
  Top 0.5: SV40.24 SV39.23
  Bottom 0.5: SV41.7 SV40.24
N$473  (2 unrouted)
  Top 0.25: SV40.26 147.32,40.64 147.32,43.68 147.15,43.85 147.15,45.67 145.2,47.62 IC6.13
  Top 0.5: SV40.26 SV39.25
  Bottom 0.5: SV41.8 SV40.26
N$474  (2 unrouted)
  Top 0.25: SV40.28 148.59,42.98 147.55,44.02 147.55,45.99 147.15,46.39 147.15,47.16 145.41,48.9 IC6.14
  Top 0.5: SV40.28 SV39.27
  Bottom 0.5: SV41.9 SV40.28
N$475  (2 unrouted)
  Top 0.25: SV40.30 148.59,45.52 147.55,46.56 147.55,48.03 145.41,50.16 IC6.15
  Top 0.5: SV40.30 SV39.29
  Bottom 0.5: SV41.10 SV40.30
N$476  (2 unrouted)
  Top 0.25: IC6.16 145.41,51.44 147.55,49.3 147.55,49.1 148.59,48.06 SV40.32
  Top 0.5: SV40.32 SV39.31
N$477  (2 unrouted)
  Top 0.25: SV40.34 145.41,52.7 IC6.17
  Top 0.5: SV40.34 SV39.33
N$478  (2 unrouted)
  Top 0.25: SV40.36 146.69,53.98 IC6.18
  Top 0.5: SV40.36 SV39.35
N$479  (2 unrouted)
  Top 0.25: IC6.19 147.96,55.24 SV40.38
  Top 0.5: SV40.38 SV39.37
N$480  (2 unrouted)
  Top 0.25: IC6.20 147.96,56.52 SV40.40
  Top 0.5: SV40.40 SV39.39
VCC
  pour Top (no thermals): -1.28,120.88 177.8,120.88 177.8,-1.27 -1.28,-1.27